# EAGLE design cooked-tomato (EAGLE 7.4.0)
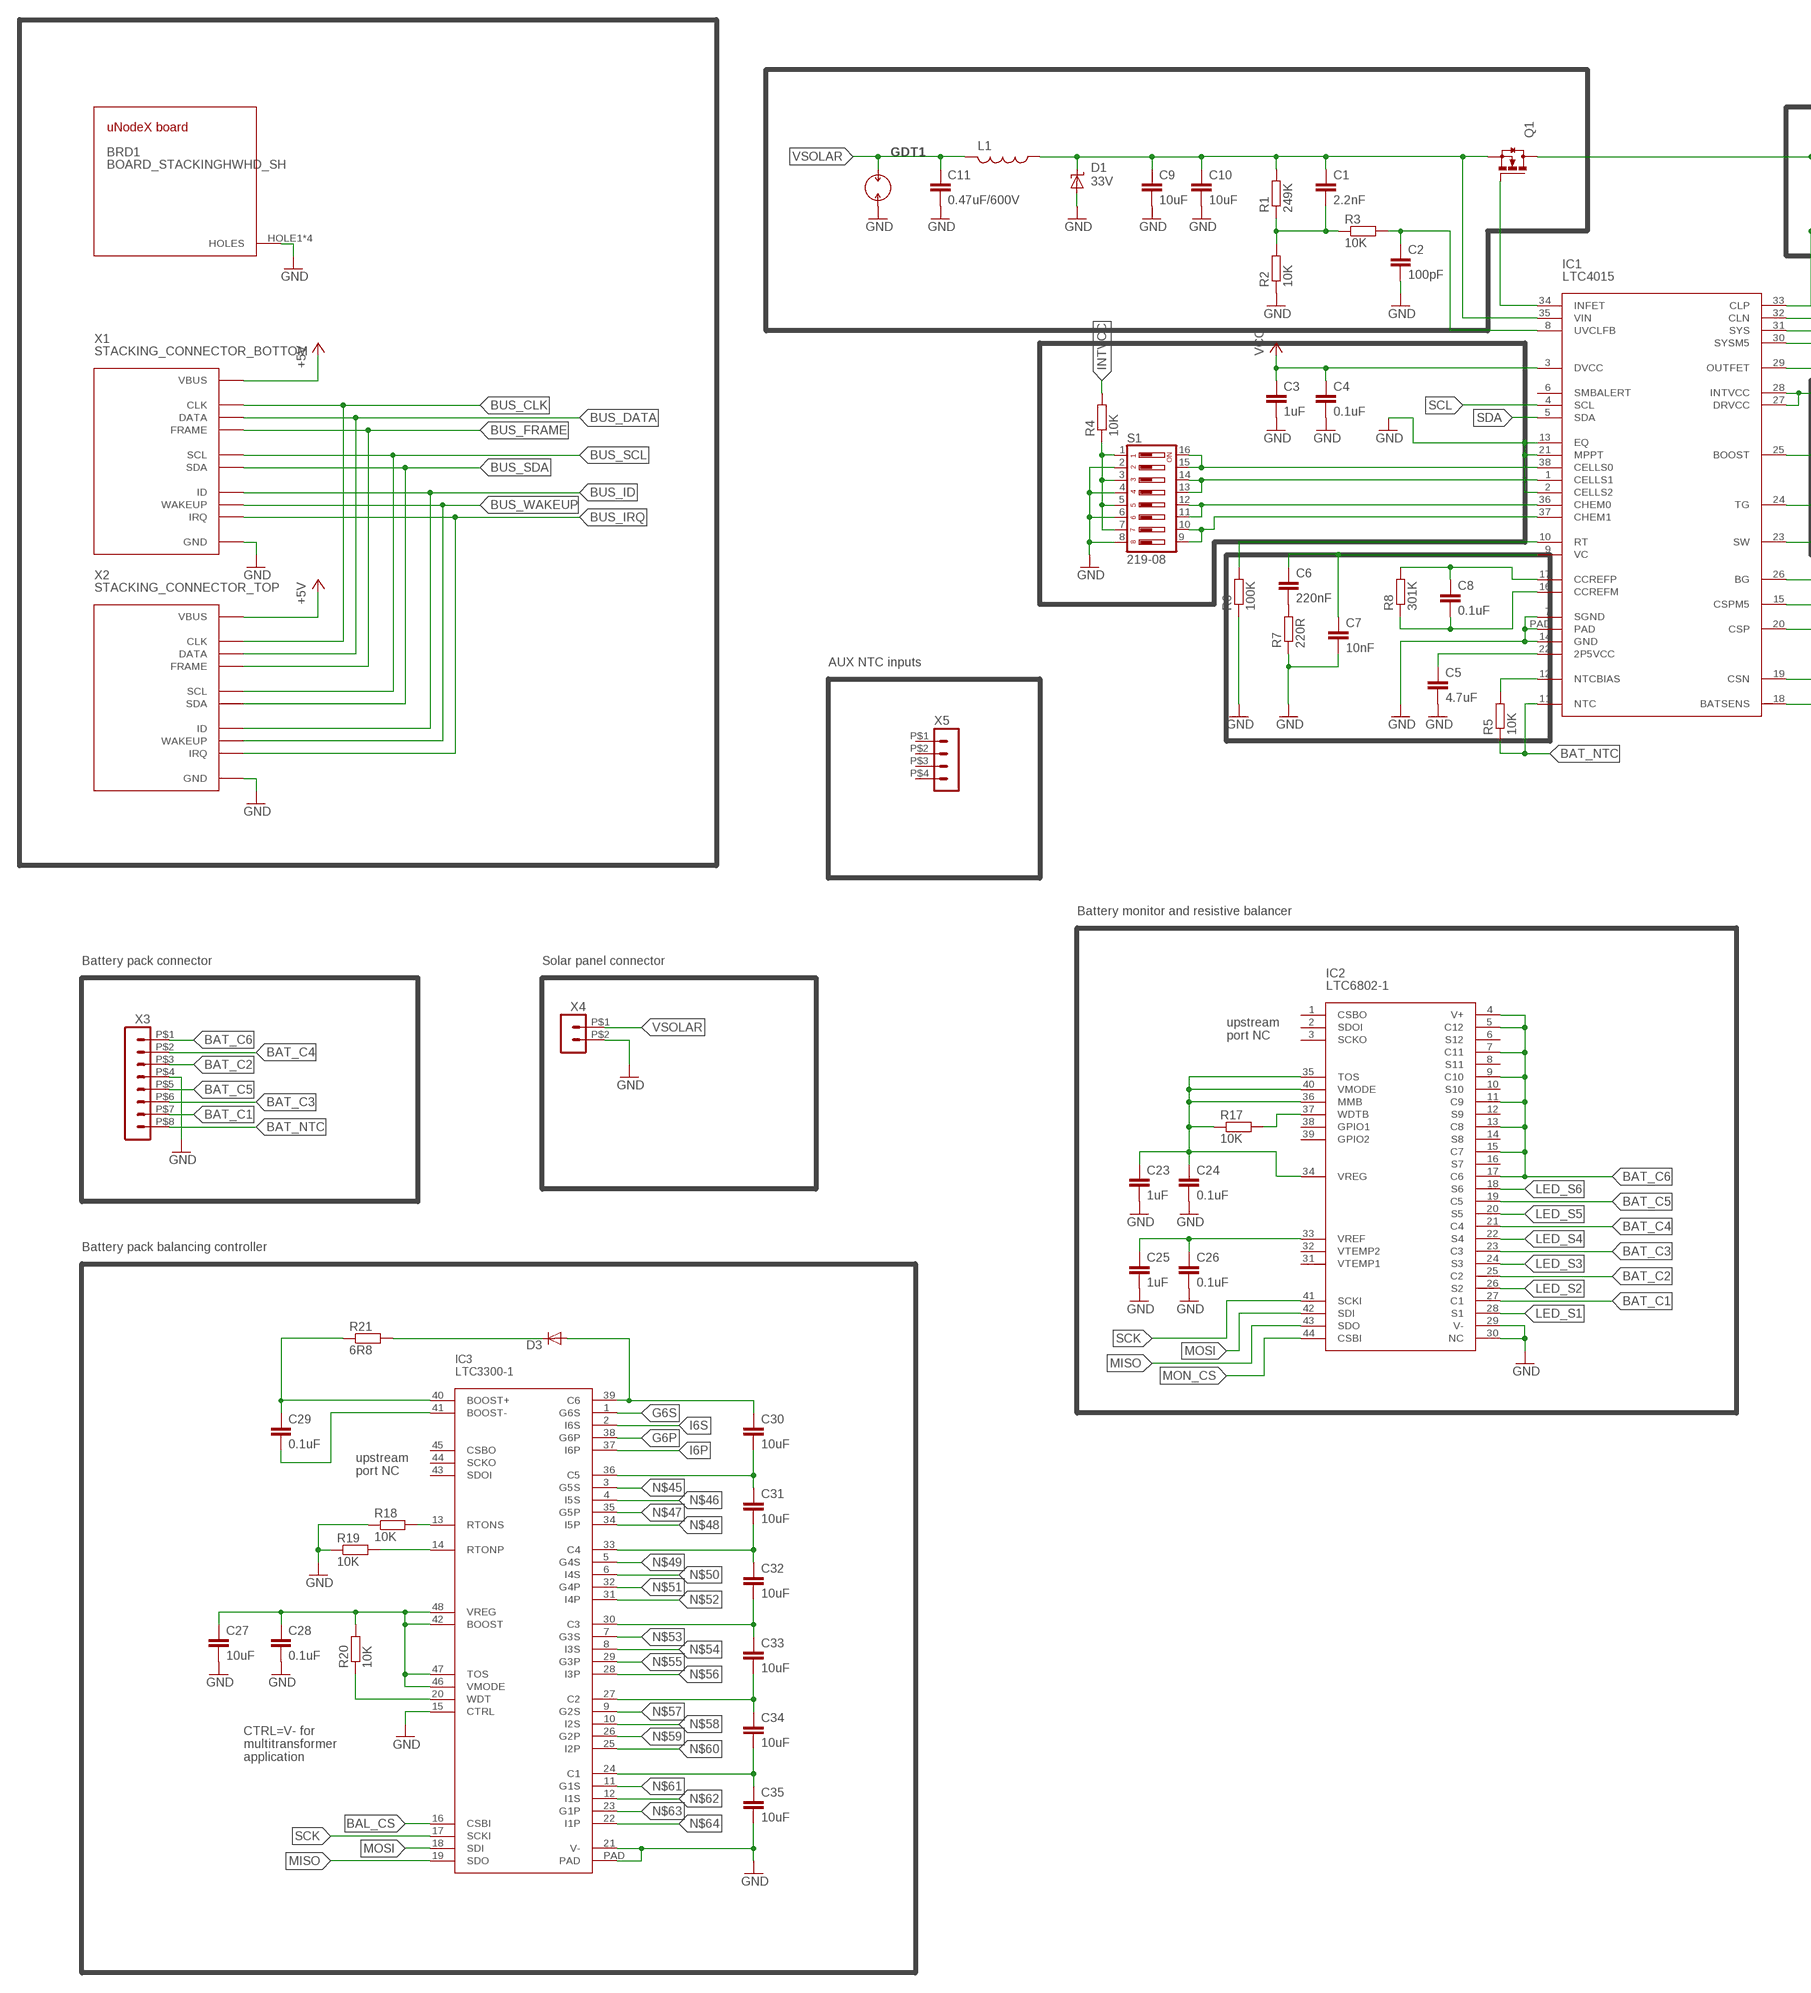
[diagram p0: schematic, sheet 1, part 1 of 3]
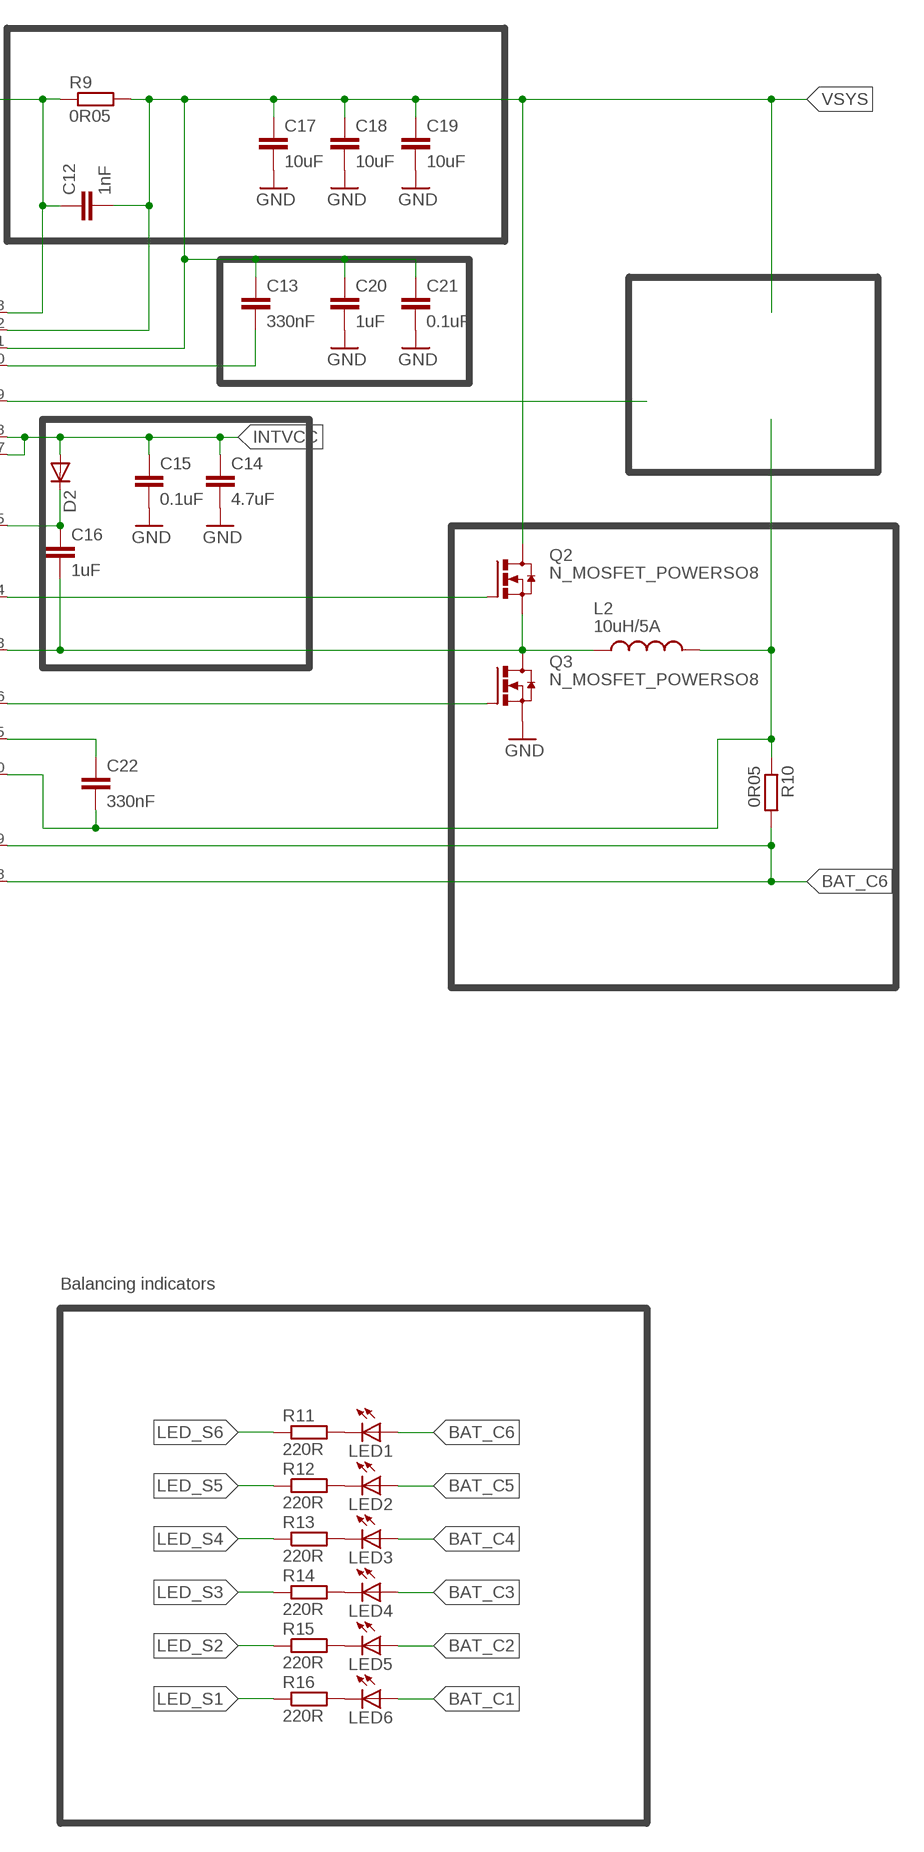
[diagram p1: schematic, sheet 1, part 2 of 3]
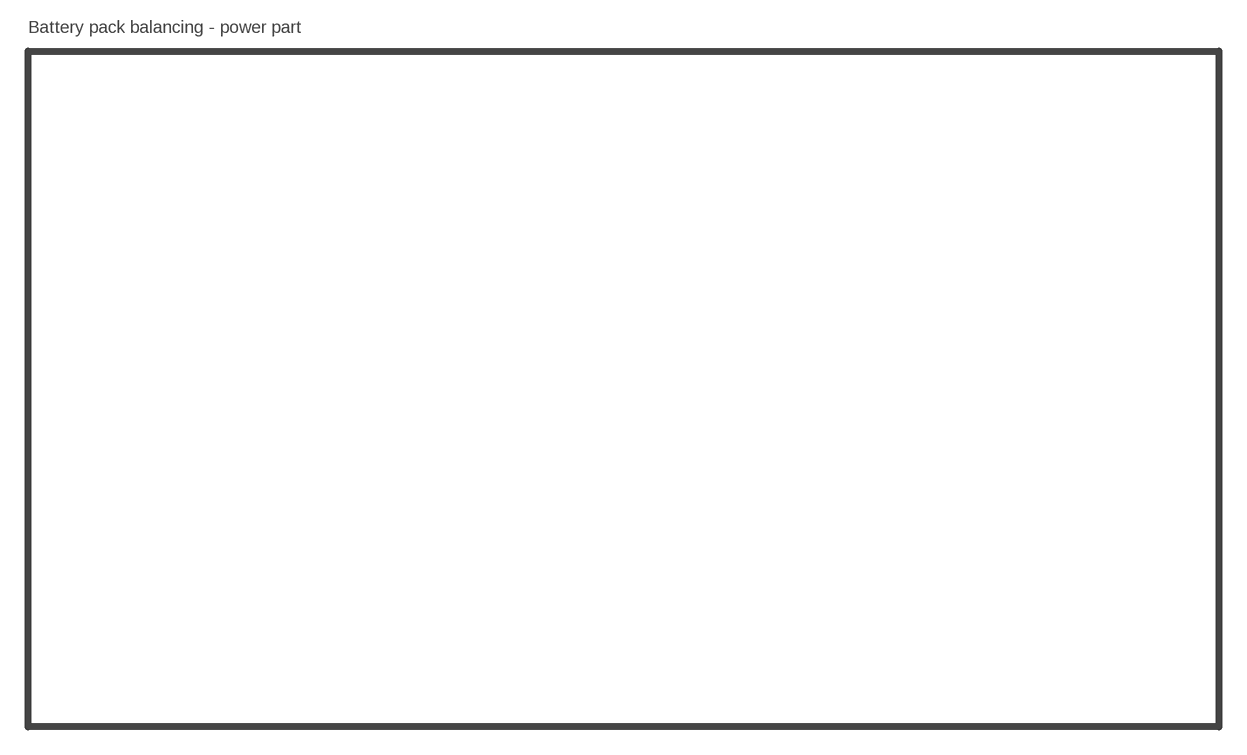
[diagram p2: schematic, sheet 1, part 3 of 3]

## Parts
BRD1  BOARD_STACKINGHWHD_SH  [HWHD_SHARP_CORNERS]
C1  2.2nF  C-EUC0603  [C0603]
C2  100pF  C-EUC0603  [C0603]
C3  1uF  C-EUC0603  [C0603]
C4  0.1uF  C-EUC0603  [C0603]
C5  4.7uF  C-EUC0805  [C0805]
C6  220nF  C-EUC0603  [C0603]
C7  10nF  C-EUC0603  [C0603]
C8  0.1uF  C-EUC0603  [C0603]
C9  10uF  C-EUC2220K  [C2220K]
C10  10uF  C-EUC2220K  [C2220K]
C11  0.47uF/600V  C-EUC1206  [C1206]
C12  1nF  C-EUC0603  [C0603]
C13  330nF  C-EUC0603  [C0603]
C14  4.7uF  C-EUC0805  [C0805]
C15  0.1uF  C-EUC0603  [C0603]
C16  1uF  C-EUC0603  [C0603]
C17  10uF  C-EUC2220K  [C2220K]
C18  10uF  C-EUC2220K  [C2220K]
C19  10uF  C-EUC2220K  [C2220K]
C20  1uF  C-EUC0805  [C0805]
C21  0.1uF  C-EUC0603  [C0603]
C22  330nF  C-EUC0603  [C0603]
C23  1uF  C-EUC0805  [C0805]
C24  0.1uF  C-EUC0603  [C0603]
C25  1uF  C-EUC0805  [C0805]
C26  0.1uF  C-EUC0603  [C0603]
C27  10uF  C-EUC0805  [C0805]
C28  0.1uF  C-EUC0603  [C0603]
C29  0.1uF  C-EUC0603  [C0603]
C30  10uF  C-EUC1206  [C1206]
C31  10uF  C-EUC1206  [C1206]
C32  10uF  C-EUC1206  [C1206]
C33  10uF  C-EUC1206  [C1206]
C34  10uF  C-EUC1206  [C1206]
C35  10uF  C-EUC1206  [C1206]
D1  33V  SUPPRESSOR-SMBJ  [SMBJ]
D2  DIODE-SOD323-W  [SOD323-W]
D3  DIODE-SOD323-W  [SOD323-W]
GDT1  2035-09-SM-RPLF  [2035-09-SM-RPLF]
IC1  LTC4015  [QFN38]
IC2  LTC6802-1  [SSOP44]
IC3  LTC3300-1  [LQFP48]
L1  L-USL4532P  [L4532P]
L2  10uH/5A  INDUCTOR7070  [L7070]
LED1  LEDCHIP-LED0805  [CHIP-LED0805]
LED2  LEDCHIP-LED0805  [CHIP-LED0805]
LED3  LEDCHIP-LED0805  [CHIP-LED0805]
LED4  LEDCHIP-LED0805  [CHIP-LED0805]
LED5  LEDCHIP-LED0805  [CHIP-LED0805]
LED6  LEDCHIP-LED0805  [CHIP-LED0805]
Q1  N_MOSFET_POWERSO8  [POWERSO8]
Q2  N_MOSFET_POWERSO8  [POWERSO8]
Q3  N_MOSFET_POWERSO8  [POWERSO8]
R1  249K  R-EU_R0603  [R0603]
R2  10K  R-EU_R0603  [R0603]
R3  10K  R-EU_R0603  [R0603]
R4  10K  R-EU_R0603  [R0603]
R5  10K  R-EU_R0603  [R0603]
R6  100K  R-EU_R0603  [R0603]
R7  220R  R-EU_R0603  [R0603]
R8  301K  R-EU_R0603  [R0603]
R9  0R05  R-EU_R2512  [R2512]
R10  0R05  R-EU_R2512  [R2512]
R11  220R  R-EU_R0603  [R0603]
R12  220R  R-EU_R0603  [R0603]
R13  220R  R-EU_R0603  [R0603]
R14  220R  R-EU_R0603  [R0603]
R15  220R  R-EU_R0603  [R0603]
R16  220R  R-EU_R0603  [R0603]
R17  10K  R-EU_R0603  [R0603]
R18  10K  R-EU_R0603  [R0603]
R19  10K  R-EU_R0603  [R0603]
R20  10K  R-EU_R0603  [R0603]
R21  6R8  R-EU_R0603  [R0603]
S1  219-08  [CTS-219-08]
X1  STACKING_CONNECTOR_BOTTOM  [HAR-FLEX-BOTTOM-12P]
X2  STACKING_CONNECTOR_TOP  [HAR-FLEX-TOP-12P]
X3  HEADER_POS8_43045-0800  [43045-0800]
X4  HEADER_POS2_43650-0200  [43650-0200]
X5  HEADER_POS4_43045-0401  [43045-0400]

## Nets
+5V: X1.VBUS X2.VBUS
BAL_CS: IC3.16(CSBI)
BAT_C1: IC2.27(C1) LED6.A X3.P$7
BAT_C2: IC2.25(C2) LED5.A X3.P$3
BAT_C3: IC2.23(C3) LED4.A X3.P$6
BAT_C4: IC2.21(C4) LED3.A X3.P$2
BAT_C5: IC2.19(C5) LED2.A X3.P$5
BAT_C6: IC1.18(BATSENS) IC1.19(CSN) IC2.4(V+) IC2.5(C12) IC2.7(C11) IC2.9(C10) IC2.11(C9) IC2.13(C8) IC2.15(C7) IC2.17(C6) LED1.A R10.2 X3.P$1
BAT_NTC: IC1.11(NTC) R5.1 X3.P$8
BUS_CLK: X1.CLK X2.CLK
BUS_DATA: X1.DATA X2.DATA
BUS_FRAME: X1.FRAME X2.FRAME
BUS_ID: X1.ID X2.ID
BUS_IRQ: X1.IRQ X2.IRQ
BUS_SCL: X1.SCL X2.SCL
BUS_SDA: X1.SDA X2.SDA
BUS_WAKEUP: X1.WAKEUP X2.WAKEUP
CELLS0: IC1.38(CELLS0) S1.15 S1.16
CELLS1: IC1.1(CELLS1) S1.13 S1.14
CHEM0: IC1.36(CHEM0) S1.11 S1.12
CHEM1: IC1.37(CHEM1) S1.9 S1.10
G6P: IC3.38(G6P)
G6S: IC3.1(G6S)
GND: BRD1.HOLE1(HOLES) BRD1.HOLE2(HOLES) BRD1.HOLE3(HOLES) BRD1.HOLE4(HOLES) C2.2 C3.2 C4.2 C5.2 C7.2 C9.2 C10.2 C11.2 C14.2 C15.2 C17.2 C18.2 C19.2 C20.2 C21.2 C23.2 C24.2 C25.2 C26.2 C27.2 C28.2 C35.2 D1.A GDT1.2 IC1.2(CELLS2) IC1.7(SGND) IC1.13(EQ) IC1.14(GND) IC1.21(MPPT) IC1.PAD IC2.29(V-) IC2.30(NC) IC3.15(CTRL) IC3.21(V-) IC3.PAD Q3.1(S) Q3.2(S) Q3.3(S) R2.1 R6.1 R7.1 R18.1 R19.1 S1.2 S1.4 S1.6 S1.8 X1.GND1(GND) X1.GND2(GND) X1.GND3(GND) X1.H1(GND) X1.H2(GND) X1.H3(GND) X1.H4(GND) X2.GND1(GND) X2.GND2(GND) X2.GND3(GND) X2.H1(GND) X2.H2(GND) X2.H3(GND) X2.H4(GND) X3.P$4 X4.P$2
I6P: IC3.37(I6P)
I6S: IC3.2(I6S)
INTVCC: C14.1 C15.1 D2.A IC1.27(DRVCC) IC1.28(INTVCC) R4.2
LED_S1: IC2.28(S1) R16.1
LED_S2: IC2.26(S2) R15.1
LED_S3: IC2.24(S3) R14.1
LED_S4: IC2.22(S4) R13.1
LED_S5: IC2.20(S5) R12.1
LED_S6: IC2.18(S6) R11.1
MISO: IC2.43(SDO) IC3.19(SDO)
MON_CS: IC2.44(CSBI)
MOSI: IC2.42(SDI) IC3.18(SDI)
N$1: IC1.34(INFET) Q1.4(G)
N$2: C13.2 IC1.30(SYSM5)
N$3: C2.1 IC1.8(UVCLFB) R3.2
N$4: C1.2 R1.1 R2.2 R3.1
N$5: IC1.12(NTCBIAS) R5.2
N$6: C5.1 IC1.22(2P5VCC)
N$7: IC1.10(RT) R6.2
N$8: C6.2 R7.2
N$9: LED2.C R12.2
N$10: R4.1 S1.1 S1.3 S1.5 S1.7
N$11: C6.1 C7.1 IC1.9(VC)
N$12: C8.1 IC1.17(CCREFP) R8.2
N$13: C8.2 IC1.16(CCREFM) R8.1
N$14: C1.1 C9.1 C10.1 D1.C IC1.35(VIN) L1.1 Q1.1(S) Q1.2(S) Q1.3(S) R1.2
N$15: C12.1 IC1.33(CLP) Q1.5(D) Q1.6(D) Q1.7(D) Q1.8(D) Q1.PAD(D) R9.1
N$16: IC1.24(TG) Q2.4(G)
N$17: C16.1 D2.C IC1.25(BOOST)
N$18: C16.2 IC1.23(SW) L2.1 Q2.1(S) Q2.2(S) Q2.3(S) Q3.5(D) Q3.6(D) Q3.7(D) Q3.8(D) Q3.PAD(D)
N$19: IC1.26(BG) Q3.4(G)
N$20: LED3.C R13.2
N$21: LED4.C R14.2
N$22: IC1.29(OUTFET)
N$23: C22.2 IC1.20(CSP) L2.2 R10.1
N$24: C22.1 IC1.15(CSPM5)
N$25: LED5.C R15.2
N$26: LED6.C R16.2
N$27: C25.1 C26.1 IC2.33(VREF)
N$28: IC3.13(RTONS) R18.2
N$29: LED1.C R11.2
N$30: C23.1 C24.1 IC2.34(VREG) IC2.35(TOS) IC2.36(MMB) IC2.40(VMODE) R17.1
N$31: IC2.37(WDTB) R17.2
N$32: IC3.14(RTONP) R19.2
N$33: IC3.20(WDT) R20.1
N$34: C27.1 C28.1 IC3.42(BOOST) IC3.46(VMODE) IC3.47(TOS) IC3.48(VREG) R20.2
N$35: C29.2 IC3.41(BOOST-)
N$36: C29.1 IC3.40(BOOST+) R21.1
N$37: D3.C R21.2
N$38: C30.1 D3.A IC3.39(C6)
N$39: C30.2 C31.1 IC3.36(C5)
N$40: C31.2 C32.1 IC3.33(C4)
N$41: C32.2 C33.1 IC3.30(C3)
N$42: C33.2 C34.1 IC3.27(C2)
N$43: C34.2 C35.1 IC3.24(C1)
N$45: IC3.3(G5S)
N$46: IC3.4(I5S)
N$47: IC3.35(G5P)
N$48: IC3.34(I5P)
N$49: IC3.5(G4S)
N$50: IC3.6(I4S)
N$51: IC3.32(G4P)
N$52: IC3.31(I4P)
N$53: IC3.7(G3S)
N$54: IC3.8(I3S)
N$55: IC3.29(G3P)
N$56: IC3.28(I3P)
N$57: IC3.9(G2S)
N$58: IC3.10(I2S)
N$59: IC3.26(G2P)
N$60: IC3.25(I2P)
N$61: IC3.11(G1S)
N$62: IC3.12(I1S)
N$63: IC3.23(G1P)
N$64: IC3.22(I1P)
SCK: IC2.41(SCKI) IC3.17(SCKI)
SCL: IC1.4(SCL)
SDA: IC1.5(SDA)
VCC: C3.1 C4.1 IC1.3(DVCC)
VSOLAR: C11.1 GDT1.1 L1.2 X4.P$1
VSYS: C12.2 C13.1 C17.1 C18.1 C19.1 C20.1 C21.1 IC1.31(SYS) IC1.32(CLN) Q2.5(D) Q2.6(D) Q2.7(D) Q2.8(D) Q2.PAD(D) R9.2
Unconnected: IC1.6(SMBALERT) IC2.1(CSBO) IC2.2(SDOI) IC2.3(SCKO) IC2.6(S12) IC2.8(S11) IC2.10(S10) IC2.12(S9) IC2.14(S8) IC2.16(S7) IC2.31(VTEMP1) IC2.32(VTEMP2) IC2.38(GPIO1) IC2.39(GPIO2) IC3.43(SDOI) IC3.44(SCKO) IC3.45(CSBO) X5.P$1 X5.P$2 X5.P$3 X5.P$4

## Notes on the sheet
- AUX NTC inputs
- Battery monitor and resistive balancer
- Battery pack connector | Solar panel connector
- Balancing indicators
- upstream
  port NC
- Battery pack balancing controller
- upstream
  port NC
- CTRL=V- for
  multitransformer
  application
- Battery pack balancing - power part

## Library data of the parts
BRD1 = unodex-boards:BOARD_STACKING
C1-C35 = rcl:C-EU: CAPACITOR, European symbol
D1 = diode:SUPPRESSOR-: Suppressor diode
D2 D3 = diode:DIODE-: DIODE
GDT1 = spark-gaps:2035-09-SM-RPLF
IC1 = chargers:LTC4015
IC2 = monitors:LTC6802-1
IC3 = balancers:LTC3300-1
L1 = rcl:L-US: INDUCTOR, American symbol
L2 = smd-inductors:INDUCTOR
LED1-LED6 = led:LED: LED OSRAM: - CHIPLED LG R971, LG N971, LY N971, LG Q971, LY Q971, LO R971, LY R971 LH N974, LH R974 LS Q976, LO Q976, LY Q976 LO Q996 - Hyper CHIPLED LW Q18S LB Q993, LB Q99A, LB R99A - SideLED LS A670, LO A670, LY A670, LG A670, LP A670 LB A673, LV A673, LT A673, LW A673 LH A674 LY A675 LS A676, LA A676, LO A676, LY A676, LW A676 LS A679, LY A679, LG A679 - Hyper Micro SIDELED® LS Y876, LA Y876, LO Y876, LY Y876 LT Y87S - SmartLED LW L88C, LW L88S LB L89C, LB L89S, LG L890 LS L89K, LO L89K, LY L89K LS L896, LA L896, LO L896, LY L896 - TOPLED LS T670, LO T670, LY T670, LG T670, LP T670 LSG T670, LSP T670, LSY T670, LOP T670, LYG T670 LG T671, LOG T671, LSG T671 LB T673, LV T673, LT T673, LW T673 LH T674 LS T676, LA T676, LO T676, LY T676, LB T676, LH T676, LSB T676, LW T676 LB T67C, LV T67C, LT T67C, LS T67K, LO T67K, LY T67K, LW E67C LS E67B, LA E67B, LO E67B, LY E67B, LB E67C, LV E67C, LT E67C LW T67C LS T679, LY T679, LG T679 LS T770, LO T770, LY T770, LG T770, LP T770 LB T773, LV T773, LT T773, LW T773 LH T774 LS E675, LA E675, LY E675, LS T675 LS T776, LA T776, LO T776, LY T776, LB T776 LHGB T686 LT T68C, LB T68C - Hyper Mini TOPLED® LB M676 - Mini TOPLED Santana® LG M470 LS M47K, LO M47K, LY M47K Source: http://www.osram.convergy.de LUXEON: - LUMILED® LXK2-PW12-R00, LXK2-PW12-S00, LXK2-PW14-U00, LXK2-PW14-V00 LXK2-PM12-R00, LXK2-PM12-S00, LXK2-PM14-U00 LXK2-PE12-Q00, LXK2-PE12-R00, LXK2-PE12-S00, LXK2-PE14-T00, LXK2-PE14-U00 LXK2-PB12-K00, LXK2-PB12-L00, LXK2-PB12-M00, LXK2-PB14-N00, LXK2-PB14-P00, LXK2-PB14-Q00 LXK2-PR12-L00, LXK2-PR12-M00, LXK2-PR14-Q00, LXK2-PR14-R00 LXK2-PD12-Q00, LXK2-PD12-R00, LXK2-PD12-S00 LXK2-PH12-R00, LXK2-PH12-S00 LXK2-PL12-P00, LXK2-PL12-Q00, LXK2-PL12-R00 Source: www.luxeon.com KINGBRIGHT: KA-3528ASYC Source: www.kingbright.com
Q1-Q3 = power-mosfet:N_MOSFET_POWERSO8
R1-R21 = rcl:R-EU_: RESISTOR, European symbol
S1 = switch-dil:219-08*: Surface Mount DIP Switch Series 219 SMT CTS Electronic Components Sourc: www.ctscorp.com; OC_FARNELL: unknown; OC_NEWARK: unknown
X1 = unodex-boards:STACKING_CONNECTOR_BOTTOM
X2 = unodex-boards:STACKING_CONNECTOR_TOP
X3 = con-molex-micro-fit-3_0:HEADER_POS8_?: Molex - Micro-Fit 3.0 Series connector, 3.00mm (0.118") pitch header, 8 positions.
X4 = con-molex-micro-fit-3_0:HEADER_POS2_?: Molex - Micro-Fit 3.0 Series connector, 3.00mm (0.118") pitch header, 2 positions.
X5 = con-molex-micro-fit-3_0:HEADER_POS4_?: Molex - Micro-Fit 3.0 Series connector, 3.00mm (0.118") pitch header, 4 positions.

## Net classes
0 default: width 0.2 mm, drill 0.3 mm, clearance 0.2 mm

## Board
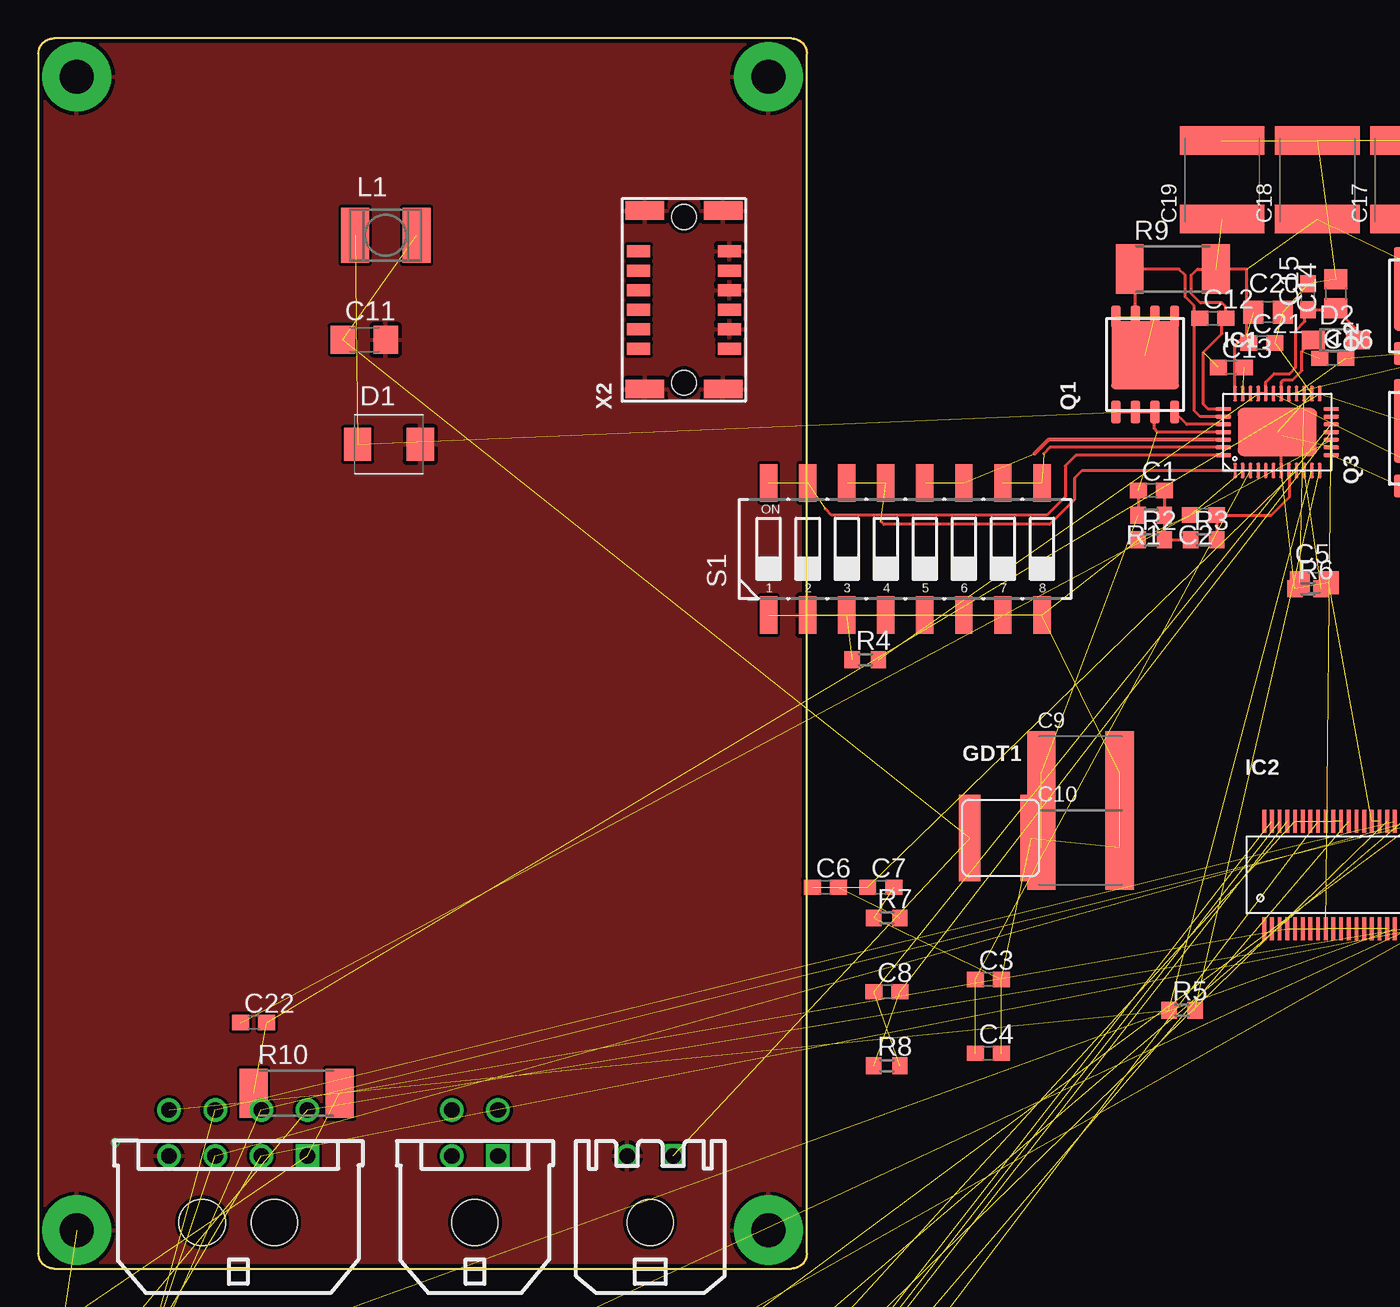
[diagram p3: board, top side]
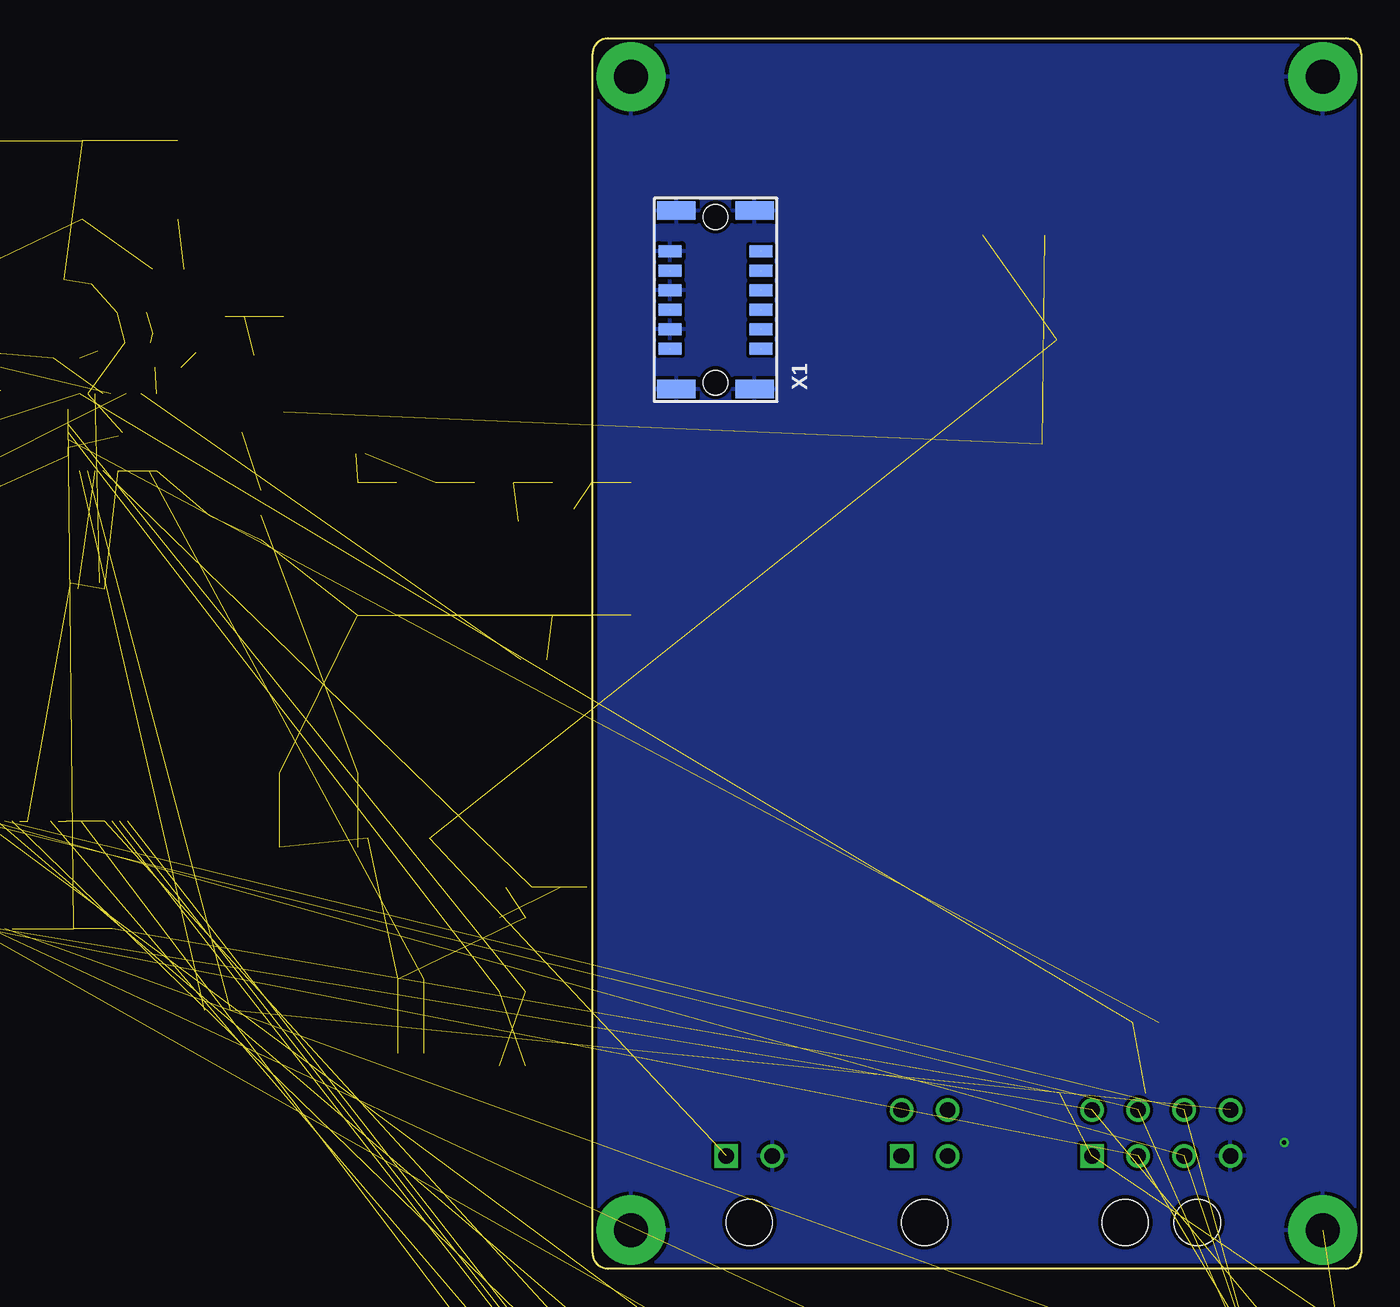
[diagram p4: board, bottom side, seen from below]

Size 50 x 80 mm. Coordinates in mm from the lower left corner, seen from the top.
Copper layers (1*16): Top 0.035mm / dielectric 1.5mm / Bottom 0.035mm
Design rules "seeed *": minimum track width 6mil, minimum drill 0.3mm, track to track 0.2mm, track to pad 0.2mm, pad to pad 0.2mm, via to via 0.2mm, smd to smd 0mil, copper to edge 10mil, drill to drill 10mil, minimum pad ring 6mil, minimum via ring 6mil, stop-mask expansion 2mil, vias tented up to drill 0.5mm, thermal gap 10mil

### Footprints (pad centres in the part's own frame; a part is rotated, then mirrored left to right if it is on the bottom)
HWHD_SHARP_CORNERS = drill 2.2 pad 4.5: HOLE1 2.5,2.5; HOLE2 47.5,2.5; HOLE3 47.5,77.5; HOLE4 2.5,77.5
C0603 = smd 1.1 x 1: 1 -0.85,0; 2 0.85,0
C0805 = smd 1.3 x 1.5: 1 -0.95,0; 2 0.95,0
C2220K = smd 1.85 x 5.5: 1 -2.55,0; 2 2.55,0
C1206 = smd 1.6 x 1.8: 1 -1.4,0; 2 1.4,0
SMBJ = smd 1.78 x 2.16: A 2.04,0; C -2.03,0
SOD323-W = smd 1.5 x 1.2: A 1.45,0; C -1.45,0
2035-09-SM-RPLF = smd 1.4 x 5.6: 1 -2,0; 2 2,0
QFN38 = smd 0.25 x 1: 1 -2.75,-2.5; 2 -2.25,-2.5; 3 -1.75,-2.5; 4 -1.25,-2.5; 5 -0.75,-2.5; 6 -0.25,-2.5; 7 0.25,-2.5; 8 0.75,-2.5; 9 1.25,-2.5; 10 1.75,-2.5; 11 2.25,-2.5; 12 2.75,-2.5; 20 2.75,2.5; 21 2.25,2.5; 22 1.75,2.5; 23 1.25,2.5; 24 0.75,2.5; 25 0.25,2.5; 26 -0.25,2.5; 27 -0.75,2.5; 28 -1.25,2.5; 29 -1.75,2.5; 30 -2.25,2.5; 31 -2.75,2.5 | smd 1 x 0.25: 13 3.5,-1.5; 14 3.5,-1; 15 3.5,-0.5; 16 3.5,0; 17 3.5,0.5; 18 3.5,1; 19 3.5,1.5; 32 -3.5,1.5; 33 -3.5,1; 34 -3.5,0.5; 35 -3.5,0; 36 -3.5,-0.5; 37 -3.5,-1; 38 -3.5,-1.5 | smd 5.15 x 3.15: PAD 0,0
SSOP44 = smd 0.25 x 1.5: 1 -5.25,-3.5; 2 -4.75,-3.5; 3 -4.25,-3.5; 4 -3.75,-3.5; 5 -3.25,-3.5; 6 -2.75,-3.5; 7 -2.25,-3.5; 8 -1.75,-3.5; 9 -1.25,-3.5; 10 -0.75,-3.5; 11 -0.25,-3.5; 12 0.25,-3.5; 13 0.75,-3.5; 14 1.25,-3.5; 15 1.75,-3.5; 16 2.25,-3.5; 17 2.75,-3.5; 18 3.25,-3.5; 19 3.75,-3.5; 20 4.25,-3.5; 21 4.75,-3.5; 22 5.25,-3.5; 23 5.25,3.5; 24 4.75,3.5; 25 4.25,3.5; 26 3.75,3.5; 27 3.25,3.5; 28 2.75,3.5; 29 2.25,3.5; 30 1.75,3.5; 31 1.25,3.5; 32 0.75,3.5; 33 0.25,3.5; 34 -0.25,3.5; 35 -0.75,3.5; 36 -1.25,3.5; 37 -1.75,3.5; 38 -2.25,3.5; 39 -2.75,3.5; 40 -3.25,3.5; 41 -3.75,3.5; 42 -4.25,3.5; 43 -4.75,3.5; 44 -5.25,3.5
LQFP48 = smd 0.25 x 1.5: 1 -2.75,-4.25; 2 -2.25,-4.25; 3 -1.75,-4.25; 4 -1.25,-4.25; 5 -0.75,-4.25; 6 -0.25,-4.25; 7 0.25,-4.25; 8 0.75,-4.25; 9 1.25,-4.25; 10 1.75,-4.25; 11 2.25,-4.25; 12 2.75,-4.25; 25 2.75,4.25; 26 2.25,4.25; 27 1.75,4.25; 28 1.25,4.25; 29 0.75,4.25; 30 0.25,4.25; 31 -0.25,4.25; 32 -0.75,4.25; 33 -1.25,4.25; 34 -1.75,4.25; 35 -2.25,4.25; 36 -2.75,4.25 | smd 1.5 x 0.25: 13 4.25,-2.75; 14 4.25,-2.25; 15 4.25,-1.75; 16 4.25,-1.25; 17 4.25,-0.75; 18 4.25,-0.25; 19 4.25,0.25; 20 4.25,0.75; 21 4.25,1.25; 22 4.25,1.75; 23 4.25,2.25; 24 4.25,2.75; 37 -4.25,2.75; 38 -4.25,2.25; 39 -4.25,1.75; 40 -4.25,1.25; 41 -4.25,0.75; 42 -4.25,0.25; 43 -4.25,-0.25; 44 -4.25,-0.75; 45 -4.25,-1.25; 46 -4.25,-1.75; 47 -4.25,-2.25; 48 -4.25,-2.75 | smd 3.6 x 3.6: PAD 0,0
L4532P = smd 1.8 x 3.6: 1 -2,0; 2 2,0
L7070 = smd 2.4 x 4: 1 -3,0; 2 3,0
CHIP-LED0805 = smd 1.2 x 1.2: A 0,-1.05; C 0,1.05
POWERSO8 = smd 1.5 x 0.6: 1 -3.1,1.905; 2 -3.1,0.635; 3 -3.1,-0.635; 4 -3.1,-1.905; 5 3.1,-1.905; 6 3.1,-0.635; 7 3.1,0.635; 8 3.1,1.905 | smd 4.4 x 4.4: PAD 0.6,0
R0603 = smd 1 x 1.1: 1 -0.85,0; 2 0.85,0
R2512 = smd 1.8 x 3.2: 1 -2.8,0; 2 2.8,0
CTS-219-08 = smd 1.13 x 2.44: 1 -8.89,-4.3; 2 -6.35,-4.3; 3 -3.81,-4.3; 4 -1.27,-4.3; 5 1.27,-4.3; 6 3.81,-4.3; 7 6.35,-4.3; 8 8.89,-4.3; 9 8.89,4.3; 10 6.35,4.3; 11 3.81,4.3; 12 1.27,4.3; 13 -1.27,4.3; 14 -3.81,4.3; 15 -6.35,4.3; 16 -8.89,4.3
HAR-FLEX-BOTTOM-12P = smd 1.5 x 0.8 bottom: CLK -5.05,-15.105; DATA -5.05,-17.645; FRAME -5.05,-20.185; GND1 -5.05,-13.835; GND2 -5.05,-16.375; GND3 -5.05,-18.915; ID -10.95,-16.375; IRQ -10.95,-13.835; SCL -10.95,-17.645; SDA -10.95,-18.915; VBUS -10.95,-20.185; WAKEUP -10.95,-15.105 | smd 2.5 x 1.2 bottom: H1 -10.55,-22.8; H2 -5.45,-22.8; H3 -5.45,-11.2; H4 -10.55,-11.2 | hole 1.6: -8,-11.615; -8,-22.385
HAR-FLEX-TOP-12P = smd 1.5 x 0.8: CLK -5.05,-15.105; DATA -5.05,-17.645; FRAME -5.05,-20.185; GND1 -5.05,-13.835; GND2 -5.05,-16.375; GND3 -5.05,-18.915; ID -10.95,-16.375; IRQ -10.95,-13.835; SCL -10.95,-17.645; SDA -10.95,-18.915; VBUS -10.95,-20.185; WAKEUP -10.95,-15.105 | smd 2.5 x 1.2: H1 -10.55,-22.8; H2 -5.45,-22.8; H3 -5.45,-11.2; H4 -10.55,-11.2 | hole 1.6: -8,-11.615; -8,-22.385
43045-0800 = drill 1.02 square: P$1 4.5,4.32 | drill 1.02: P$2 1.5,4.32; P$3 -1.5,4.32; P$4 -4.5,4.32; P$5 4.5,7.32; P$6 1.5,7.32; P$7 -1.5,7.32; P$8 -4.5,7.32 | hole 3: 2.35,0; -2.35,0
43650-0200 = drill 1.02 square: P$1 1.5,4.32 | drill 1.02: P$2 -1.5,4.32 | hole 3: 0,0
43045-0400 = drill 1.02 square: P$1 1.5,4.32 | drill 1.02: P$2 -1.5,4.32; P$3 1.5,7.32; P$4 -1.5,7.32 | hole 3: 0,0

### Placement (x,y rotation side)
BRD1  0,0 0 top
C1  72.4,50.6 0 top  (outside the outline)
C2  75.8,49 180 top  (outside the outline)
C3  61.8,18.8 0 top  (outside the outline)
C4  61.8,14 0 top  (outside the outline)
C5  83,44.6 0 top  (outside the outline)
C6  51.2,24.8 0 top
C7  54.8,24.8 0 top  (outside the outline)
C8  55.2,18 0 top  (outside the outline)
C9  67.8,32.2 0 top  (outside the outline)
C10  67.8,27.4 0 top  (outside the outline)
C11  21.2,60.4 0 top
C12  76.4,61.8 0 top  (outside the outline)
C13  77.6,58.6 0 top  (outside the outline)
C14  84.4,63.4 90 top  (outside the outline)
C15  82.6,63.2 90 top  (outside the outline)
C16  84.2,59.2 0 top  (outside the outline)
C17  89.4,70.8 90 top  (outside the outline)
C18  83.2,70.8 90 top  (outside the outline)
C19  77,70.8 90 top  (outside the outline)
C20  80,62.2 0 top  (outside the outline)
C21  79.6,60.2 0 top  (outside the outline)
C22  14,16 0 top
C23  -9.8,-72.4 0 top  (outside the outline)
C24  -10.4,-77.8 0 top  (outside the outline)
C25  -9.8,-83.2 0 top  (outside the outline)
C26  -10.4,-88.6 0 top  (outside the outline)
C27  -20.2,-108.4 0 top  (outside the outline)
C28  -20.6,-113.8 0 top  (outside the outline)
C29  -20.6,-123.4 0 top  (outside the outline)
C30  -20.2,-137.4 0 top  (outside the outline)
C31  -20.2,-143.6 0 top  (outside the outline)
C32  -20.2,-149.8 0 top  (outside the outline)
C33  -20.2,-156 0 top  (outside the outline)
C34  -20.2,-162.2 0 top  (outside the outline)
C35  -20.2,-168.4 0 top  (outside the outline)
D1  22.8,53.6 0 top
D2  84.4,60.4 0 top  (outside the outline)
D3  -20,-128.6 0 top  (outside the outline)
GDT1  62.6,28 0 top  (outside the outline)
IC1  80.6,54.4 0 top  (outside the outline)
IC2  85,25.6 0 top  (outside the outline)
IC3  -17.2,-90.6 0 top  (outside the outline)
L1  22.6,67.2 0 top
L2  97.2,55.4 270 top  (outside the outline)
LED1  -9,-9.6 0 top  (outside the outline)
LED2  -9,-20.4 0 top  (outside the outline)
LED3  -9,-31 0 top  (outside the outline)
LED4  -9,-41.6 0 top  (outside the outline)
LED5  -9,-52.2 0 top  (outside the outline)
LED6  -9,-62.8 0 top  (outside the outline)
Q1  72,58.8 90 top  (outside the outline)
Q2  90.4,62.6 90 top  (outside the outline)
Q3  90.4,54 90 top  (outside the outline)
R1  72.4,49 180 top  (outside the outline)
R2  72.4,47.4 0 top  (outside the outline)
R3  75.8,47.4 0 top  (outside the outline)
R4  53.8,39.6 0 top
R5  74.4,16.8 0 top  (outside the outline)
R6  82.6,44.2 0 top  (outside the outline)
R7  55.2,22.8 0 top  (outside the outline)
R8  55.2,13.2 0 top  (outside the outline)
R9  73.8,65 0 top  (outside the outline)
R10  16.8,11.4 0 top
R11  -10.4,-14 0 top  (outside the outline)
R12  -10.4,-24.6 0 top  (outside the outline)
R13  -10.4,-35.2 0 top  (outside the outline)
R14  -10.4,-45.8 0 top  (outside the outline)
R15  -10.4,-56.4 0 top  (outside the outline)
R16  -10.4,-67 0 top  (outside the outline)
R17  -10.4,-93.4 0 top  (outside the outline)
R18  -20.6,-98.2 0 top  (outside the outline)
R19  -20.6,-103 0 top  (outside the outline)
R20  -20.6,-118.6 0 top  (outside the outline)
R21  -20.6,-132 0 top  (outside the outline)
S1  56.4,46.8 0 top
X1  50,80 0 top
X2  50,80 0 top
X3  13,3 0 top
X4  39.8,3 0 top
X5  28.4,3 0 top

### Tracks (layer width: path | path; a pad name or v marks a point on that pad's centre or on a via)
+5V  (1 unrouted)
BAT_C1  (2 unrouted)
BAT_C2  (2 unrouted)
BAT_C3  (2 unrouted)
BAT_C4  (2 unrouted)
BAT_C5  (2 unrouted)
BAT_C6  (12 unrouted)
BAT_NTC  (2 unrouted)
BUS_CLK  (1 unrouted)
BUS_DATA  (1 unrouted)
BUS_FRAME  (1 unrouted)
BUS_ID  (1 unrouted)
BUS_IRQ  (1 unrouted)
BUS_SCL  (1 unrouted)
BUS_SDA  (1 unrouted)
BUS_WAKEUP  (1 unrouted)
CELLS0  (2 unrouted)
  Top 0.2: IC1.38 67.5,52.9 66.8,52.2 66.8,50.2 65.6,49 51.6,49 51.2,49.4
CELLS1  (2 unrouted)
  Top 0.2: IC1.1 67.9,51.9 67.4,51.4 67.4,50 65.8,48.4 55,48.4 54.8,48.6
CHEM0  (2 unrouted)
  Top 0.254: IC1.36 65.7,53.9 64.8,53
CHEM1  (2 unrouted)
  Top 0.2: IC1.37 65.8,53.4 65.4,53
GND  (via drill 0.3)  (43 unrouted)
  Top 0.2: IC1.7 80.85,54.15 IC1.PAD
  other vias: 5,8.2
  pour Top (rank 2): 0,80 50,80 50,0 0,0
  pour Bottom (rank 2): 0,80 50,80 50,0 0,0
INTVCC  (1 unrouted)
  Top 0.2: IC1.28 IC1.27 79.85,57.65 80.4,58.2 81.4,58.2 81.8,58.6 81.8,61 82.4,61.6 82.4,62.15 C15.1 84.3,62.35 C14.1 85.85,61 D2.A
LED_S1  (1 unrouted)
LED_S2  (1 unrouted)
LED_S3  (1 unrouted)
LED_S4  (1 unrouted)
LED_S5  (1 unrouted)
LED_S6  (1 unrouted)
MISO  (1 unrouted)
MOSI  (1 unrouted)
N$1
  Top 0.2: IC1.34 74.7,54.9 Q1.4
N$2  (1 unrouted)
N$3
  Top 0.2: R3.2 C2.1 80.2,49 81.4,50.2 81.4,51.85 IC1.8
N$4
  Top 0.2: C1.2 R1.1 R2.2 R3.1
N$5  (1 unrouted)
N$6  (1 unrouted)
N$7  (1 unrouted)
N$8  (1 unrouted)
N$9  (1 unrouted)
N$10  (4 unrouted)
N$11  (2 unrouted)
N$12  (2 unrouted)
N$13  (2 unrouted)
N$14  (5 unrouted)
  Top 0.2: Q1.1 Q1.2 Q1.3 72.6,55.66 72.6,54.6 72.8,54.4 IC1.35 | C1.1 R1.2
N$15  (4 unrouted)
  Top 0.2: Q1.7 71.36,64.64 R9.1 74.2,65 74.6,64.6 74.6,63.2 75.2,62.6 75.2,61.45 | IC1.33 75.6,55.4 75.2,55.8 75.2,61.45 | 75.2,61.45 C12.1
N$16  (1 unrouted)
N$17  (1 unrouted)
  Top 0.2: IC1.25 80.85,57.65 81,57.8 81.6,57.8 82.2,58.4 82.2,59.65 D2.C
N$18  (10 unrouted)
N$19  (1 unrouted)
N$20  (1 unrouted)
N$21  (1 unrouted)
N$23  (3 unrouted)
N$24  (1 unrouted)
N$25  (1 unrouted)
N$26  (1 unrouted)
N$27  (2 unrouted)
N$28  (1 unrouted)
N$29  (1 unrouted)
N$30  (6 unrouted)
N$31  (1 unrouted)
N$32  (1 unrouted)
N$33  (1 unrouted)
N$34  (6 unrouted)
N$35  (1 unrouted)
N$36  (2 unrouted)
N$37  (1 unrouted)
N$38  (2 unrouted)
N$39  (2 unrouted)
N$40  (2 unrouted)
N$41  (2 unrouted)
N$42  (2 unrouted)
N$43  (2 unrouted)
SCK  (1 unrouted)
VCC  (2 unrouted)
VSOLAR  (3 unrouted)
VSYS  (11 unrouted)
  Top 0.2: IC1.32 76.1,55.9 75.8,56.2 75.8,59.6 77,60.8 77,61.55 C12.2 77.25,62.55 77,62.8 75.6,62.8 75,63.4 75,64.6 75.4,65 R9.2 78.6,65 78.6,60.8 77.85,60.05 IC1.31